# EAGLE design Clock (EAGLE 8.3.1)
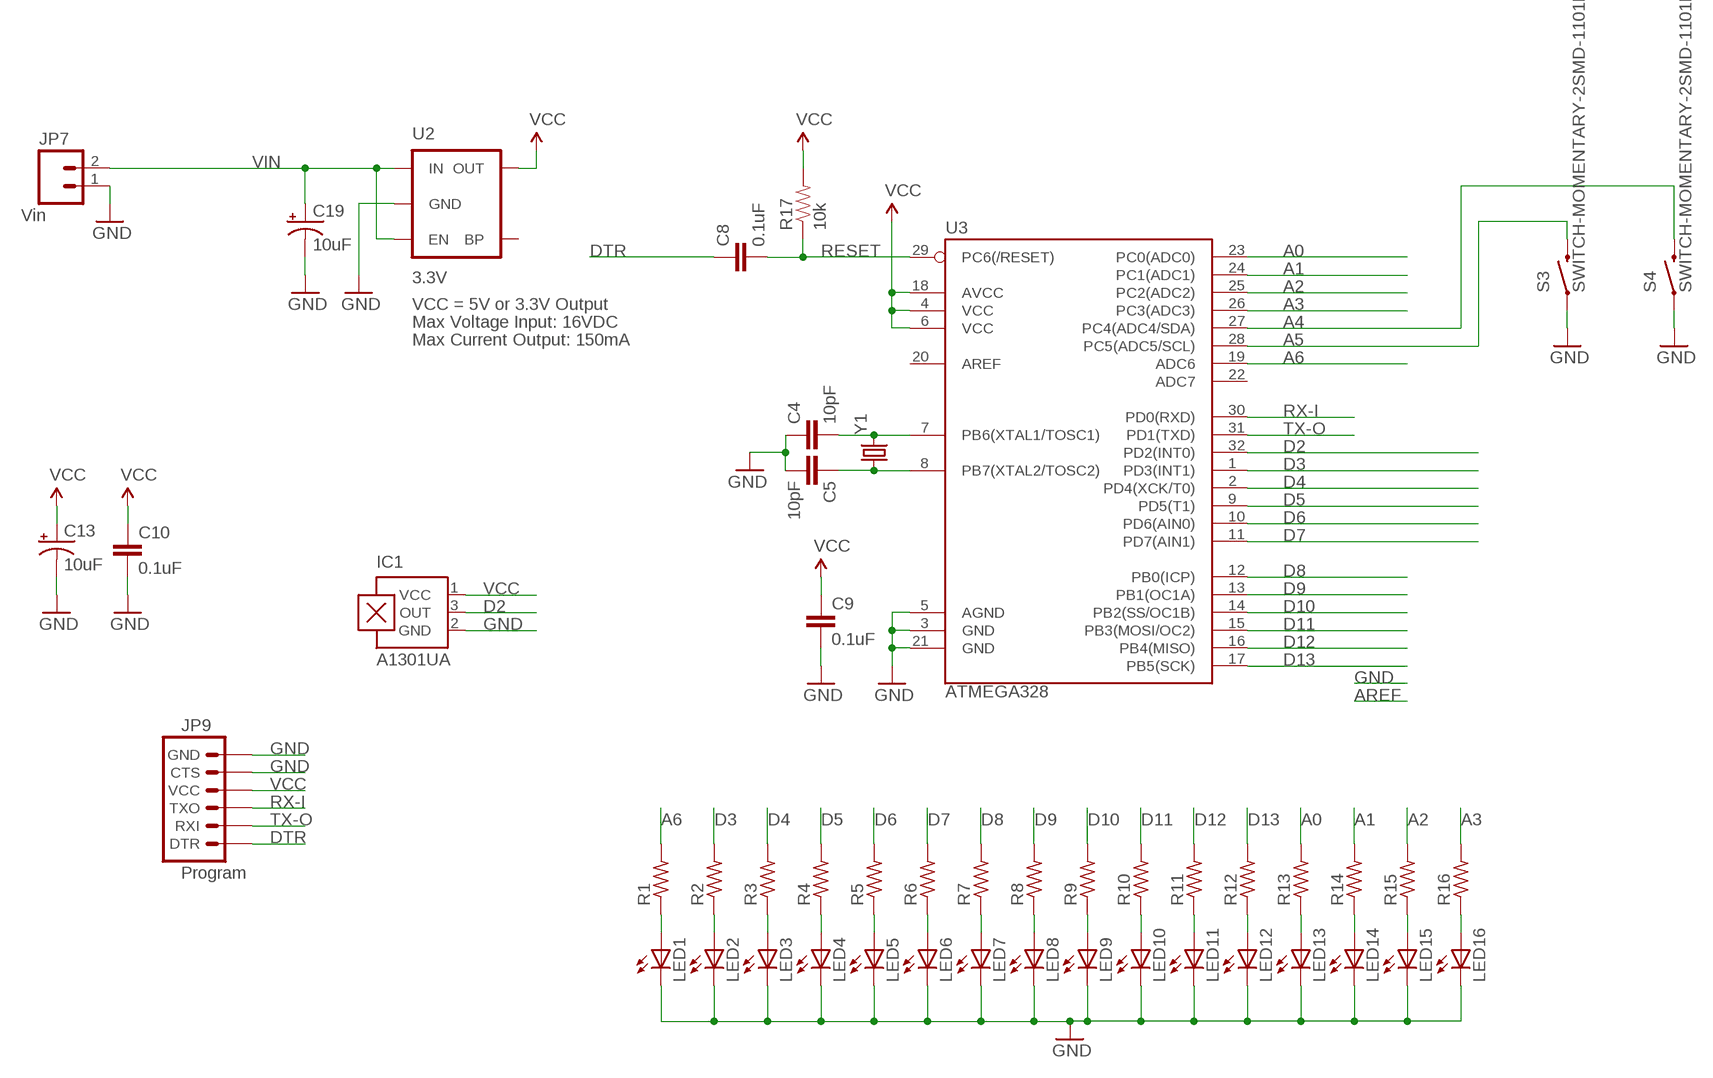
[diagram p0: schematic, sheet 1]

## Parts
C4  10pF  CAP0603-CAP  [0603-CAP]
C5  10pF  CAP0603-CAP  [0603-CAP]
C8  0.1uF  CAP0603-CAP  [0603-CAP]
C9  0.1uF  CAP0603-CAP  [0603-CAP]
C10  0.1uF  CAP0603-CAP  [0603-CAP]
C13  10uF  CAP_POL1206  [EIA3216]
C19  10uF  CAP_POL1206  [EIA3216]
IC1  A1301UA  [SIP3-UA]
JP7  Vin  M02PTH  [1X02]
JP9  Program  ARDUINO_SERIAL_PROGRAMSMD  [1X06-SMD]
LED1  LEDCHIPLED_1206  [CHIPLED_1206]
LED2  LEDCHIPLED_1206  [CHIPLED_1206]
LED3  LEDCHIPLED_1206  [CHIPLED_1206]
LED4  LEDCHIPLED_1206  [CHIPLED_1206]
LED5  LEDCHIPLED_1206  [CHIPLED_1206]
LED6  LEDCHIPLED_1206  [CHIPLED_1206]
LED7  LEDCHIPLED_1206  [CHIPLED_1206]
LED8  LEDCHIPLED_1206  [CHIPLED_1206]
LED9  LEDCHIPLED_1206  [CHIPLED_1206]
LED10  LEDCHIPLED_1206  [CHIPLED_1206]
LED11  LEDCHIPLED_1206  [CHIPLED_1206]
LED12  LEDCHIPLED_1206  [CHIPLED_1206]
LED13  LEDCHIPLED_1206  [CHIPLED_1206]
LED14  LEDCHIPLED_1206  [CHIPLED_1206]
LED15  LEDCHIPLED_1206  [CHIPLED_1206]
LED16  LEDCHIPLED_1206  [CHIPLED_1206]
R1  R-US_R0603  [R0603]
R2  R-US_R0603  [R0603]
R3  R-US_R0603  [R0603]
R4  R-US_R0603  [R0603]
R5  R-US_R0603  [R0603]
R6  R-US_R0603  [R0603]
R7  R-US_R0603  [R0603]
R8  R-US_R0603  [R0603]
R9  R-US_R0603  [R0603]
R10  R-US_R0603  [R0603]
R11  R-US_R0603  [R0603]
R12  R-US_R0603  [R0603]
R13  R-US_R0603  [R0603]
R14  R-US_R0603  [R0603]
R15  R-US_R0603  [R0603]
R16  R-US_R0603  [R0603]
R17  10k  RESISTOR0603-RES  [0603-RES]
S3  SWITCH-MOMENTARY-2SMD-1101NE  [TACTILE-SWITCH-1101NE]
S4  SWITCH-MOMENTARY-2SMD-1101NE  [TACTILE-SWITCH-1101NE]
U2  3.3V  V_REG_LDOSMD  [SOT23-5]
U3  ATMEGA328  ATMEGA168  [TQFP32-08]
Y1  CRYSTAL5X3  [CRYSTAL-SMD-5X3]

## Nets
A0: R13.2 U3.23(PC0(ADC0))
A1: R14.2 U3.24(PC1(ADC1))
A2: R15.2 U3.25(PC2(ADC2))
A3: R16.2 U3.26(PC3(ADC3))
A4: S4.2 U3.27(PC4(ADC4/SDA))
A5: S3.2 U3.28(PC5(ADC5/SCL))
A6: R1.2 U3.19(ADC6)
D2: IC1.3(OUT) U3.32(PD2(INT0))
D3: R2.2 U3.1(PD3(INT1))
D4: R3.2 U3.2(PD4(XCK/T0))
D5: R4.2 U3.9(PD5(T1))
D6: R5.2 U3.10(PD6(AIN0))
D7: R6.2 U3.11(PD7(AIN1))
D8: R7.2 U3.12(PB0(ICP))
D9: R8.2 U3.13(PB1(OC1A))
D10: R9.2 U3.14(PB2(SS/OC1B))
D11: R10.2 U3.15(PB3(MOSI/OC2))
D12: R11.2 U3.16(PB4(MISO))
D13: R12.2 U3.17(PB5(SCK))
DTR: C8.1 JP9.1(DTR)
GND [vcc]: C4.1 C5.2 C9.2 C10.2 C13.C(-) C19.C(-) IC1.2(GND) JP7.1 JP9.5(CTS) JP9.6(GND) LED1.C LED2.C LED3.C LED4.C LED5.C LED6.C LED7.C LED8.C LED9.C LED10.C LED11.C LED12.C LED13.C LED14.C LED15.C LED16.C S3.1 S4.1 U2.2(GND) U3.3(GND) U3.5(AGND) U3.21(GND)
N$1: C4.2 U3.7(PB6(XTAL1/TOSC1)) Y1.3
N$2: LED1.A R1.1
N$3: C5.1 U3.8(PB7(XTAL2/TOSC2)) Y1.1
N$5: LED2.A R2.1
N$6: LED3.A R3.1
N$7: LED4.A R4.1
N$8: LED5.A R5.1
N$9: LED6.A R6.1
N$10: LED7.A R7.1
N$11: LED8.A R8.1
N$12: LED9.A R9.1
N$13: LED10.A R10.1
N$14: LED11.A R11.1
N$15: LED12.A R12.1
N$16: LED13.A R13.1
N$17: LED14.A R14.1
N$18: LED15.A R15.1
N$19: LED16.A R16.1
RESET: C8.2 R17.1 U3.29(PC6(/RESET))
RX-I: JP9.3(TXO) U3.30(PD0(RXD))
TX-O: JP9.2(RXI) U3.31(PD1(TXD))
VCC: C9.1 C10.1 C13.A(+) IC1.1(VCC) JP9.4(VCC) R17.2 U2.5(OUT) U3.4(VCC) U3.6(VCC) U3.18(AVCC)
VIN [vcc]: C19.A(+) JP7.2 U2.1(IN) U2.3(EN)
Unconnected: U2.4(BP) U3.20(AREF) U3.22(ADC7)

## Notes on the sheet
- VCC = 5V or 3.3V Output
- Max Voltage Input: 16VDC
- Max Current Output: 150mA

## Library data of the parts
C4 C5 C8-C10 = SparkFun-Passives:CAP: Capacitor Standard 0603 ceramic capacitor, and 0.1" leaded capacitor.
C13 C19 = SparkFun:CAP_POL: Capacitor Polarized These are standard SMD and PTH capacitors. Normally 10uF, 47uF, and 100uF in electrolytic and tantalum varieties. Always verify the external diameter of the through hole cap, it varies with capacity, voltage, and manufacturer. The EIA devices should be standard.
IC1 = allegro:A13*?: Linear Hall Effect Sensor ICs Continuous-Time Ratiometric High-Temperature Operation Programmable Linear with Analog Output A1302 -Replacement- UGN3503 Source: http://www.allegromicro.com/en/Products/Part_Numbers/1301/1301.pdf http://www.allegromicro.com/en/Products/Part_Numbers/1321/1321.pdf http://www.allegromicro.com/en/Products/Part_Numbers/1381/1381.pdf; MF: ALLEGRO MICROSYSTEMS, INC.; MPN: A1301EUA-T; OC_FARNELL: 1198085; OC_NEWARK: 31K6635
JP7 = SparkFun:M02: Header 2 Standard 2-pin 0.1" header. Use with straight break away headers (SKU : PRT-00116), right angle break away headers (PRT-00553), swiss pins (PRT-00743), machine pins (PRT-00117), and female headers (PRT-00115). Molex polarized connector foot print use with SKU : PRT-08233 with associated crimp pins and housings.
JP9 = SparkFun:ARDUINO_SERIAL_PROGRAM
LED1-LED16 = led:LED: LED OSRAM: - CHIPLED LG R971, LG N971, LY N971, LG Q971, LY Q971, LO R971, LY R971 LH N974, LH R974 LS Q976, LO Q976, LY Q976 LO Q996 - Hyper CHIPLED LW Q18S LB Q993, LB Q99A, LB R99A - SideLED LS A670, LO A670, LY A670, LG A670, LP A670 LB A673, LV A673, LT A673, LW A673 LH A674 LY A675 LS A676, LA A676, LO A676, LY A676, LW A676 LS A679, LY A679, LG A679 - Hyper Micro SIDELED® LS Y876, LA Y876, LO Y876, LY Y876 LT Y87S - SmartLED LW L88C, LW L88S LB L89C, LB L89S, LG L890 LS L89K, LO L89K, LY L89K LS L896, LA L896, LO L896, LY L896 - TOPLED LS T670, LO T670, LY T670, LG T670, LP T670 LSG T670, LSP T670, LSY T670, LOP T670, LYG T670 LG T671, LOG T671, LSG T671 LB T673, LV T673, LT T673, LW T673 LH T674 LS T676, LA T676, LO T676, LY T676, LB T676, LH T676, LSB T676, LW T676 LB T67C, LV T67C, LT T67C, LS T67K, LO T67K, LY T67K, LW E67C LS E67B, LA E67B, LO E67B, LY E67B, LB E67C, LV E67C, LT E67C LW T67C LS T679, LY T679, LG T679 LS T770, LO T770, LY T770, LG T770, LP T770 LB T773, LV T773, LT T773, LW T773 LH T774 LS E675, LA E675, LY E675, LS T675 LS T776, LA T776, LO T776, LY T776, LB T776 LHGB T686 LT T68C, LB T68C - Hyper Mini TOPLED® LB M676 - Mini TOPLED Santana® LG M470 LS M47K, LO M47K, LY M47K Source: http://www.osram.convergy.de LUXEON: - LUMILED® LXK2-PW12-R00, LXK2-PW12-S00, LXK2-PW14-U00, LXK2-PW14-V00 LXK2-PM12-R00, LXK2-PM12-S00, LXK2-PM14-U00 LXK2-PE12-Q00, LXK2-PE12-R00, LXK2-PE12-S00, LXK2-PE14-T00, LXK2-PE14-U00 LXK2-PB12-K00, LXK2-PB12-L00, LXK2-PB12-M00, LXK2-PB14-N00, LXK2-PB14-P00, LXK2-PB14-Q00 LXK2-PR12-L00, LXK2-PR12-M00, LXK2-PR14-Q00, LXK2-PR14-R00 LXK2-PD12-Q00, LXK2-PD12-R00, LXK2-PD12-S00 LXK2-PH12-R00, LXK2-PH12-S00 LXK2-PL12-P00, LXK2-PL12-Q00, LXK2-PL12-R00 Source: www.luxeon.com KINGBRIGHT: KA-3528ASYC Source: www.kingbright.com
R1-R16 = resistor:R-US_: RESISTOR, American symbol
R17 = SparkFun-Passives:RESISTOR: Resistor Basic schematic elements and footprints for 0603, 1206, and PTH resistors.
S3 S4 = SparkFun-Electromechanical:SWITCH-MOMENTARY-2: Various NO switches- pushbuttons, reed, etc; PROD_ID: SWCH-00815
U2 = SparkFun:V_REG_LDO: Voltage Regulator LDO Standard 150mA LDO voltage regulator in SOT-23 layout. Micrel part MIC5205. BP (by-pass) pin is used to lower output noise with 470pF cap.
U3 = SparkFun:ATMEGA168
Y1 = SparkFun-FreqCtrl:CRYSTAL: Various standard crystals. Proven footprints.; PROD_ID: XTAL-08218

## Net classes
0 default: width 0.203 mm
1 vcc: width 0.254 mm

## Board
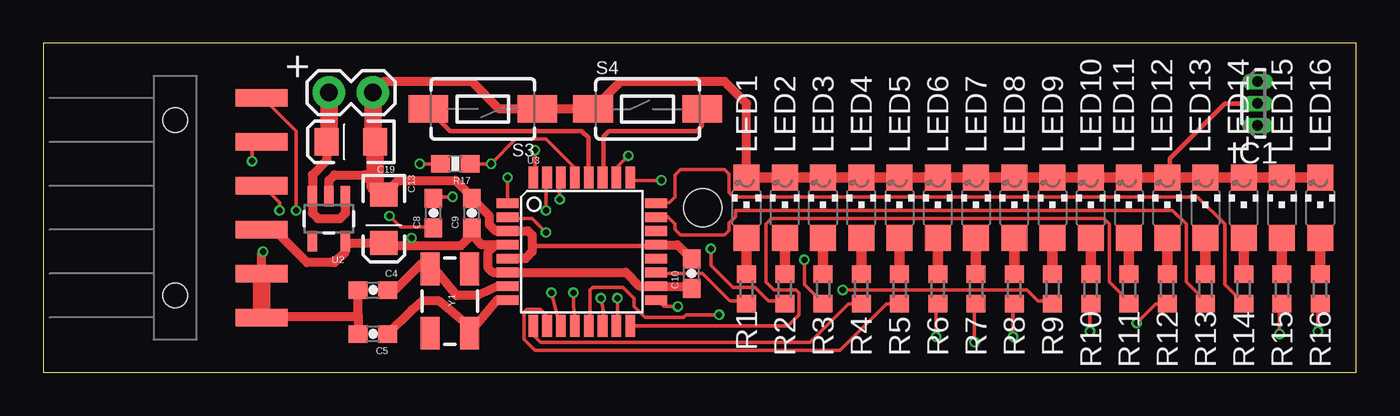
[diagram p1: board, top side]
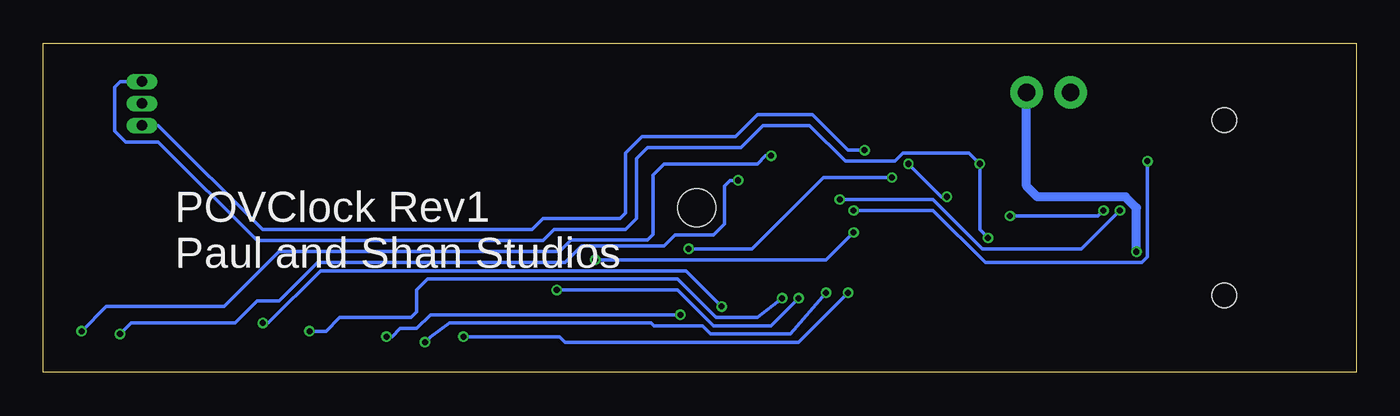
[diagram p2: board, bottom side, seen from below]

Size 75.87 x 19.04 mm. Coordinates in mm from the lower left corner, seen from the top.
Outline: 0,0 75.87,0 75.87,19.04 0,19.04 0,0
Copper layers (1*16): Top 0.035559375mm / dielectric 1.6mm / Bottom 0.035559375mm
Design rules "oshpark-2layer *": minimum track width 6mil, minimum drill 10mil, track to track 6mil, track to pad 6mil, pad to pad 6mil, via to via 6mil, smd to smd 6mil, copper to edge 15mil, drill to drill 6mil, minimum pad ring 5mil, minimum via ring 5mil, stop-mask expansion 2.5mil, vias tented up to drill 14mil, thermal gap 10mil
Holes 2.18 mm at 38.1,9.53

### Footprints (pad centres in the part's own frame; a part is rotated, then mirrored left to right if it is on the bottom)
0603-CAP = smd 1.1 x 1: 1 -0.85,0; 2 0.85,0
EIA3216 = smd 1.4 x 1.6: A 1.4,0; C -1.4,0
SIP3-UA = drill 0.6 pad 0.7 long: 1 -1.27,0; 2 0,0; 3 1.27,0
1X02 = drill 1.016 pad 1.88: 1 0,0; 2 2.54,0
1X06-SMD = smd 1 x 3: 1 -6.35,5; 2 -3.81,5; 3 -1.27,5; 4 1.27,5; 5 3.81,5; 6 6.35,5 | hole 1.4: -5.08,0; 5.08,0
CHIPLED_1206 = smd 1.5 x 1.5: A 0,-1.75; C 0,1.75
R0603 = smd 1 x 1.1: 1 -0.85,0; 2 0.85,0
0603-RES = smd 1.1 x 1: 1 -0.85,0; 2 0.85,0
TACTILE-SWITCH-1101NE = smd 2.3 x 1.6: 1 -3.15,0; 2 3.15,0
SOT23-5 = smd 0.55 x 1.2: 1 -0.95,-1.3; 2 0,-1.3; 3 0.95,-1.3; 4 0.95,1.3; 5 -0.95,1.3
TQFP32-08 = smd 1.27 x 0.559: 1 -4.293,2.8; 2 -4.293,2; 3 -4.293,1.2; 4 -4.293,0.4; 5 -4.293,-0.4; 6 -4.293,-1.2; 7 -4.293,-2; 8 -4.293,-2.8; 17 4.293,-2.8; 18 4.293,-2; 19 4.293,-1.2; 20 4.293,-0.4; 21 4.293,0.4; 22 4.293,1.2; 23 4.293,2; 24 4.293,2.8 | smd 0.559 x 1.27: 9 -2.8,-4.293; 10 -2,-4.293; 11 -1.2,-4.293; 12 -0.4,-4.293; 13 0.4,-4.293; 14 1.2,-4.293; 15 2,-4.293; 16 2.8,-4.293; 25 2.8,4.293; 26 2,4.293; 27 1.2,4.293; 28 0.4,4.293; 29 -0.4,4.293; 30 -1.2,4.293; 31 -2,4.293; 32 -2.8,4.293
CRYSTAL-SMD-5X3 = smd 1.9 x 1.1: 1 -1.85,-1.15; 2 1.85,-1.15; 3 1.85,1.15; 4 -1.85,1.15

### Placement (x,y rotation side)
C4  19.05,4.76 0 top
C5  19.05,2.22 180 top
C8  22.54,9.21 90 top
C9  24.77,9.21 90 top
C10  37.47,5.71 90 top
C13  19.68,8.89 270 top
C19  17.78,13.34 180 top
IC1  70.17,15.56 270 top
JP7  19.05,16.19 180 top
JP9  7.62,9.53 270 top
LED1  40.64,9.53 0 top
LED2  42.85,9.53 0 top
LED3  45.06,9.53 0 top
LED4  47.27,9.53 0 top
LED5  49.48,9.53 0 top
LED6  51.69,9.53 0 top
LED7  53.9,9.53 0 top
LED8  56.11,9.53 0 top
LED9  58.32,9.53 0 top
LED10  60.53,9.53 0 top
LED11  62.74,9.53 0 top
LED12  64.95,9.53 0 top
LED13  67.16,9.53 0 top
LED14  69.37,9.53 0 top
LED15  71.58,9.53 0 top
LED16  73.79,9.53 0 top
R1  40.64,4.83 270 top
R2  42.85,4.83 270 top
R3  45.06,4.83 270 top
R4  47.27,4.83 270 top
R5  49.48,4.83 270 top
R6  51.69,4.83 270 top
R7  53.9,4.83 270 top
R8  56.11,4.83 270 top
R9  58.32,4.83 270 top
R10  60.53,4.83 270 top
R11  62.74,4.83 270 top
R12  64.95,4.83 270 top
R13  67.16,4.83 270 top
R14  69.37,4.83 270 top
R15  71.58,4.83 270 top
R16  73.79,4.83 270 top
R17  23.81,12.06 180 top
S3  25.4,15.24 180 top
S4  34.92,15.24 0 top
U2  16.51,8.89 180 top
U3  31.11,6.99 0 top
Y1  23.5,4.13 90 top

### Tracks (layer width: path | path; a pad name or v marks a point on that pad's centre or on a via)
A0
  Top 0.203: R13.2 67.15,4.13 66.04,5.24 66.04,8.57 65.25,9.37 40.01,9.37 40.01,9 39.64,8.63 39.64,8.2 39.37,7.94 36.83,7.94 36.51,8.26 36.51,8.57 36.1,8.98 U3.23 35.56,8.89
A1
  Top 0.203: R14.2 69.22,4.13 68.26,5.08 68.26,8.57 66.67,10.16 39.9,10.16 39.64,10.42 39.64,11.48 39.37,11.75 36.83,11.75 36.51,11.43 36.51,10.16 36.2,9.84 35.54,9.84 35.53,9.83 | 35.53,9.83 35.56,9.84 | 35.53,9.83 U3.24
A2  (via drill 0.35)
  Top 0.203: v71.44,2.22 71.44,4.13 R15.2 | v35.72,11.11 34.13,11.11 33.97,11.27 U3.25
  Bottom 0.203: v35.72,11.11 36.2,11.11 36.51,10.79 36.51,8.57 37.15,7.94 39.37,7.94 40.01,7.3 44.77,7.3 45.72,6.35 60.01,6.35 62.23,4.13 63.5,4.13 64.77,2.86 70.8,2.86 v71.44,2.22
A3  (via drill 0.35)
  Top 0.203: v73.66,2.38 73.66,3.97 R16.2 | v33.81,12.54 33.18,11.91 33.18,11.43 U3.26
  Bottom 0.203: v73.66,2.38 72.23,3.81 65.41,3.81 62.23,6.99 46.04,6.99 45.36,7.66 40.96,7.66 40.64,7.98 40.64,11.43 40.01,12.06 34.61,12.06 34.13,12.54 v33.81,12.54
A4
  Top 0.254: S4.2 38.08,14.26 37.78,13.97 32.7,13.97 32.38,13.65 32.38,11.35 U3.27
A5
  Top 0.254: U3.28 31.52,13.57 31.11,13.97 23.52,13.97 S3.2
A6
  Top 0.203: R1.2 40.64,4.13 39.69,4.13 38.1,5.71 35.56,5.71 U3.19
D2  (via drill 0.35)
  Top 0.203: v28.42,12.86 28.42,11.43 U3.32
  Bottom 0.203: v28.42,12.86 29.37,12.86 31.43,14.92 34.61,14.92 35.88,13.65 41.27,13.65 42.23,12.7 42.23,9.21 42.55,8.89 46.99,8.89 47.62,8.26 63.18,8.26 69.22,14.29 IC1.3
D3  (via drill 0.35)
  Top 0.203: v38.58,7.14 38.58,6.19 39.85,4.92 41.12,4.92 41.91,4.13 42.7,4.13 R2.2 | v26.83,11.27 26.83,9.84 U3.1
  Bottom 0.203: v38.58,7.14 34.92,7.14 30.8,11.27 v26.83,11.27
D4  (via drill 0.35)
  Top 0.203: v43.97,6.51 43.97,5.08 44.93,4.13 R3.2 | v29.05,8.1 28.26,8.89 26.83,8.89 U3.2
  Bottom 0.203: v43.97,6.51 30.64,6.51 v29.05,8.1
D5
  Top 0.203: R4.2 47.15,3.97 46.51,3.97 44.29,1.75 28.73,1.75 28.42,2.06 28.42,2.54 U3.9
D6
  Top 0.203: R5.2 49.37,3.97 48.74,3.97 46.04,1.27 28.42,1.27 27.78,1.91 27.78,3.49 27.94,3.65 28.73,3.65 29.05,3.33 29.05,2.7 U3.10
D7  (via drill 0.35)
  Top 0.203: v51.59,2.06 51.59,3.97 R6.2 | v29.37,4.6 29.69,3.33 U3.11
  Bottom 0.203: v51.59,2.06 46.04,2.06 45.72,1.75 32.23,1.75 v29.37,4.6
D8  (via drill 0.35)
  Top 0.203: v53.82,1.75 53.82,3.97 R7.2 | v30.64,4.6 30.64,3.81 30.8,2.7 U3.12
  Bottom 0.203: v30.64,4.6 32.7,2.22 37.31,2.22 37.78,2.7 40.58,2.7 40.74,2.86 52.39,2.86 53.5,2.06 v53.82,1.75
D9  (via drill 0.35)
  Top 0.203: v56.04,2.06 56.04,3.97 R8.2 | v39.05,3.33 37.15,3.33 36.99,3.17 34.77,3.17 34.13,3.81 34.13,4.29 33.5,4.92 31.75,4.92 31.59,4.76 31.59,2.7 U3.13
  Bottom 0.203: v39.05,3.33 53.5,3.33 54.29,2.54 55.24,2.54 55.72,2.06 v56.04,2.06
D10  (via drill 0.35)
  Top 0.203: v46.2,4.76 56.83,4.76 57.47,4.13 58.26,4.13 R9.2 | v32.23,4.29 32.38,3.49 32.38,2.7 U3.14
  Bottom 0.203: v46.2,4.76 39.21,4.76 37.15,2.7 33.81,2.7 v32.23,4.29
D11  (via drill 0.35)
  Top 0.203: v60.48,2.38 60.48,3.97 R10.2 | v33.18,4.29 33.18,2.7 U3.15
  Bottom 0.203: v33.18,4.29 34.61,3.17 36.99,3.17 39.21,5.4 53.66,5.4 54.29,4.76 54.29,3.49 54.61,3.17 58.74,3.17 59.53,2.38 v60.48,2.38
D12
  Top 0.203: R11.2 62.71,4.13 61.59,5.24 61.59,8.57 61.28,8.89 42.07,8.89 41.75,8.57 41.75,5.24 42.23,4.76 43.5,4.76 43.66,4.6 43.66,3.33 43.02,2.7 33.97,2.7 U3.16
D13  (via drill 0.35)
  Top 0.203: v63.18,2.86 64.29,3.97 64.93,3.97 R12.2 | v36.67,3.81 35.88,3.81 35.56,4.13 U3.17
  Bottom 0.203: v63.18,2.86 62.87,2.86 59.85,5.87 38.73,5.87 v36.67,3.81
DTR  (via drill 0.35)
  Top 0.203: v20,9.05 20.64,8.41 22.54,8.41 C8.1 | v14.61,9.37 14.61,13.97 12.7,15.88 JP9.1
  Bottom 0.203: v20,9.05 14.92,9.05 v14.61,9.37
GND  (via drill 0.35)
  Top 0.254: 28.26,7.3 35.24,7.3 U3.21 | 69.69,15.56 IC1.2 68.26,15.56 65.09,12.38 65.09,11.91 65.56,11.43 LED12.C
  Top 0.508: U2.2 16.51,11.11 16.83,11.43 18.55,11.43 C13.C 20.51,11.11 23.81,11.11 24.77,10.15 C9.2 | JP9.5 12.62,6.91 v12.7,6.99 | C9.2 | C9.2 25.78,9.04 25.78,8.54 26.13,8.19 U3.3 28.01,8.19 28.26,7.94 28.26,7.3 28.26,6.99 27.86,6.58 U3.5 | JP7.1 19.68,16.83 24.77,16.83 26.35,15.24 S3.1 S4.1 33.36,16.83 39.37,16.83 40.64,15.56 LED1.C | U3.21 36.65,7.38 C10.2 | 18.2,3.25 C5.2 | 18.2,3.25 C4.1 | JP9.6 12.7,3.25 18.2,3.25
  Top 0.61: LED16.C LED15.C LED14.C LED13.C LED12.C LED11.C LED10.C LED9.C LED8.C LED7.C LED6.C LED5.C LED4.C LED3.C LED2.C LED1.C
  Top 1.016: JP7.1 19.05,13.46 C19.C 19.18,10.79 C13.C | JP9.5 JP9.6
  Bottom 0.508: v12.7,6.99 12.7,9.53 13.34,10.16 18.41,10.16 19.05,10.79 JP7.1
N$1
  Top 0.508: U3.7 26.26,4.99 25.08,4.45 23.88,4.45 22.37,6.27 | 22.37,6.27 Y1.3 | C4.2 20.32,4.76 21.83,6.27 22.37,6.27
N$2
  Top 0.61: LED1.A R1.1
N$3
  Top 0.508: U3.8 26.23,4.18 Y1.1 24.64,2.66 22.86,4.13 21.91,4.13 21.27,3.6 C5.1
N$5
  Top 0.61: LED2.A R2.1
N$6
  Top 0.61: LED3.A R3.1
N$7
  Top 0.61: LED4.A R4.1
N$8
  Top 0.61: LED5.A R5.1
N$9
  Top 0.61: LED6.A R6.1
N$10
  Top 0.61: LED7.A R7.1
N$11
  Top 0.61: LED8.A R8.1
N$12
  Top 0.61: LED9.A R9.1
N$13
  Top 0.61: LED10.A R10.1
N$14
  Top 0.61: LED11.A R11.1
N$15
  Top 0.61: LED12.A R12.1
N$16
  Top 0.61: LED13.A R13.1
N$17
  Top 0.61: LED14.A R14.1
N$18
  Top 0.61: LED15.A R15.1
N$19
  Top 0.61: LED16.A R16.1
RESET  (via drill 0.35)
  Top 0.203: v23.65,10.16 22.54,10.16 C8.2 | R17.1 v25.88,12.06 27.3,13.49 29.05,13.49 30.64,11.91 30.64,11.43 U3.29
  Bottom 0.203: v23.65,10.16 23.97,10.16 v25.88,12.06
RX-I  (via drill 0.35)
  Top 0.203: v29.84,10 29.84,11.27 U3.30 | v13.65,9.37 13.65,9.84 12.7,10.79 JP9.3
  Bottom 0.203: v29.84,10 24.45,10 21.59,7.14 15.88,7.14 v13.65,9.37
TX-O  (via drill 0.35)
  Top 0.203: v29.05,9.37 29.05,11.27 U3.31 | v12.06,12.22 12.06,12.86 12.54,13.34 JP9.2
  Bottom 0.203: v29.05,9.37 24.45,9.37 21.43,6.35 12.38,6.35 12.06,6.67 v12.06,12.22
VCC  (via drill 0.35)
  Top 0.203: v21.75,12.06 R17.2 | 21.27,7.33 v21.27,7.78
  Top 0.508: JP9.4 13.34,8.26 15.24,6.35 16.83,6.35 17.46,6.98 U2.5 17.56,7.49 C13.A 19.84,7.33 21.27,7.33 24.13,7.33 24.77,7.97 C9.1 24.77,7.94 25.32,7.38 U3.4 26.13,7.38 25.72,6.97 25.72,6.03 25.96,5.79 U3.6 33.67,5.79 34.47,4.99 U3.18 37.34,4.99 C10.1
  Bottom 0.203: v21.27,7.78 21.75,8.26 v21.75,12.06 22.38,12.7 26.19,12.7 26.67,12.22 29.53,12.22 31.59,14.29 34.29,14.29 35.56,13.02 40.96,13.02 41.59,12.38 41.59,8.89 42.23,8.26 46.35,8.26 46.99,7.62 63.5,7.62 69.22,13.34 71.12,13.34 71.75,13.97 71.75,16.51 71.44,16.83 IC1.1
VIN
  Top 0.508: C19.A 16.38,12.25 15.56,11.43 U2.3 | U2.3 | U2.3 15.56,9.21 15.88,8.89 17.14,8.89 17.46,9.21 U2.1
  Top 1.016: JP7.2 16.51,13.46 C19.A

### Text on the board
tNames: +
bNames: POVClock Rev1 / Paul and Shan Studios